# EasyEDA Pro project 终极板子.eprj

# Board 终极板子
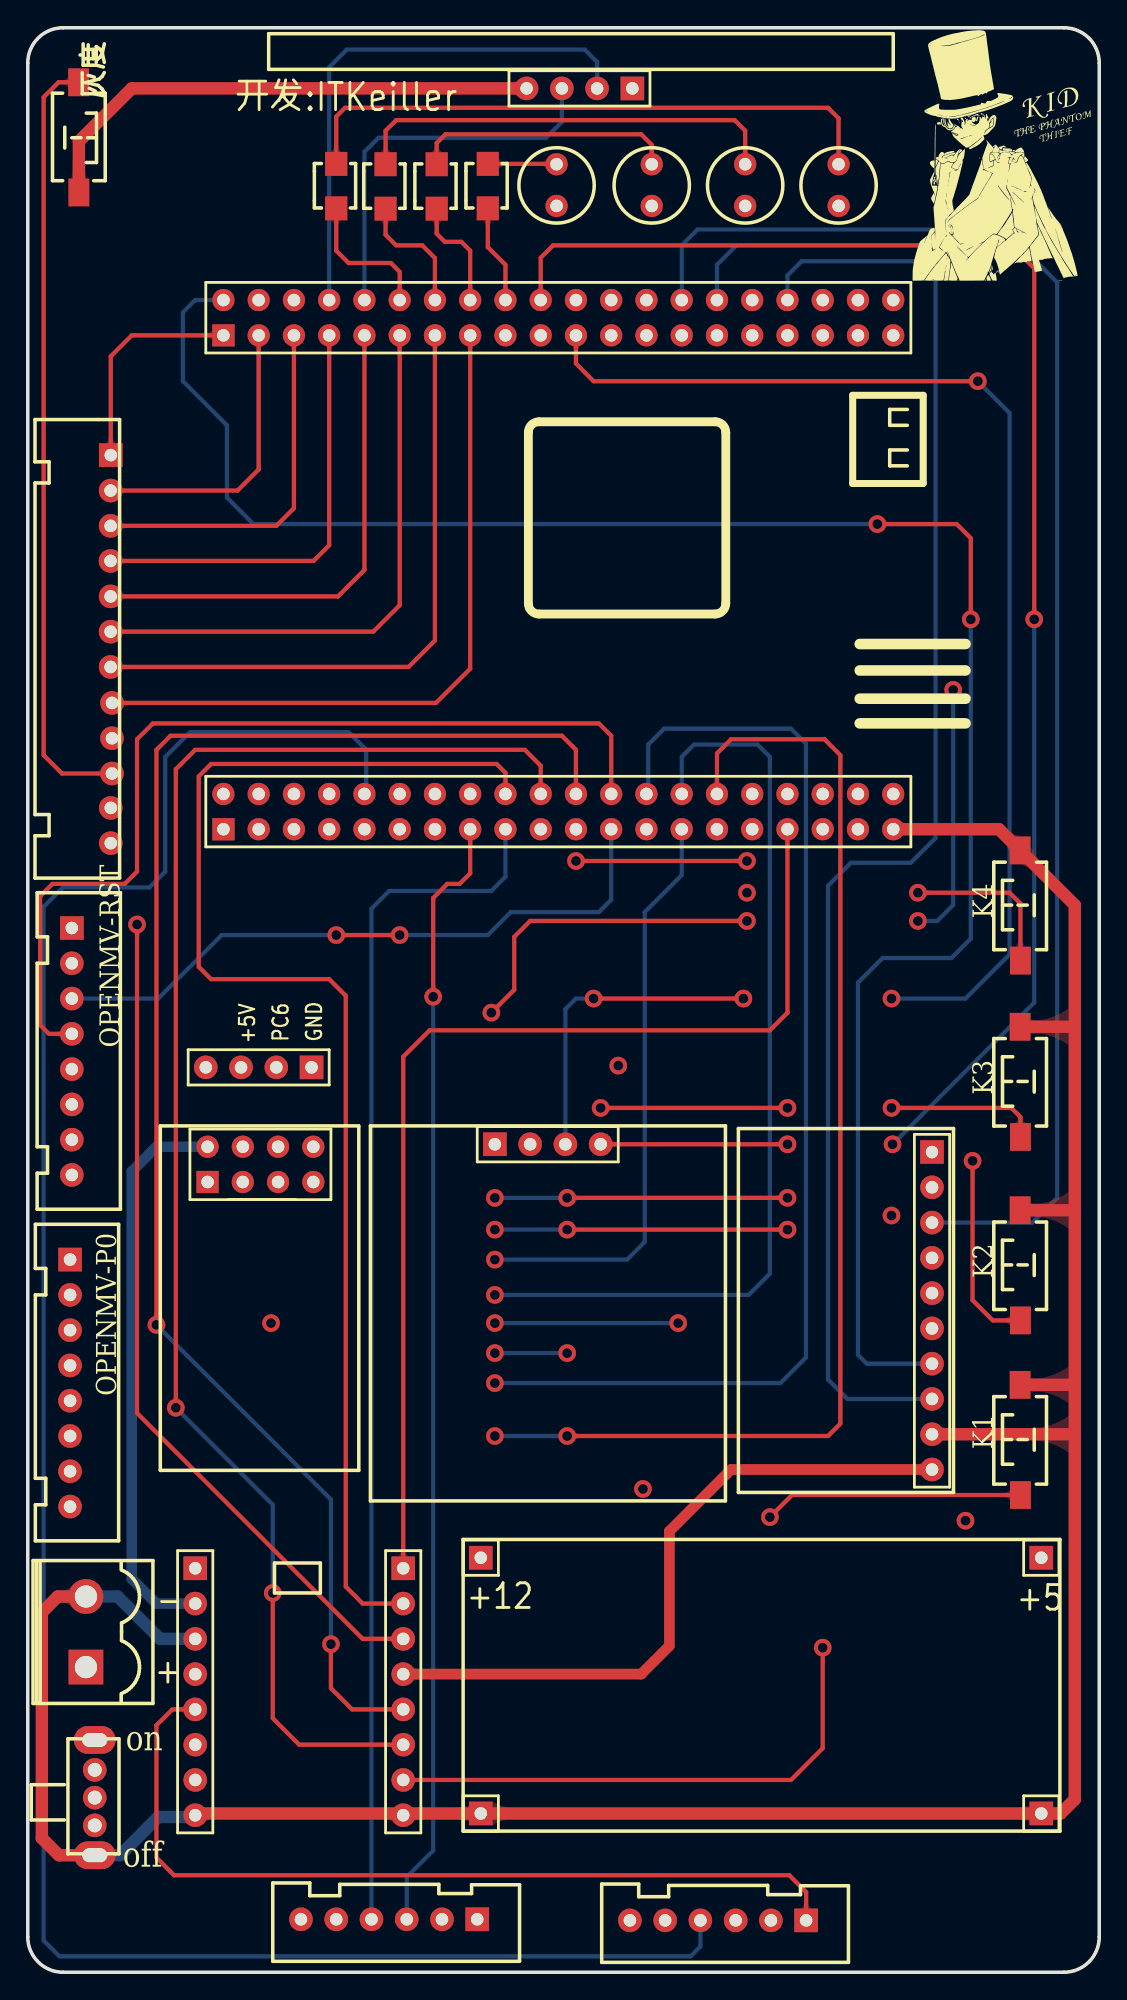
[diagram p0: board, top side]
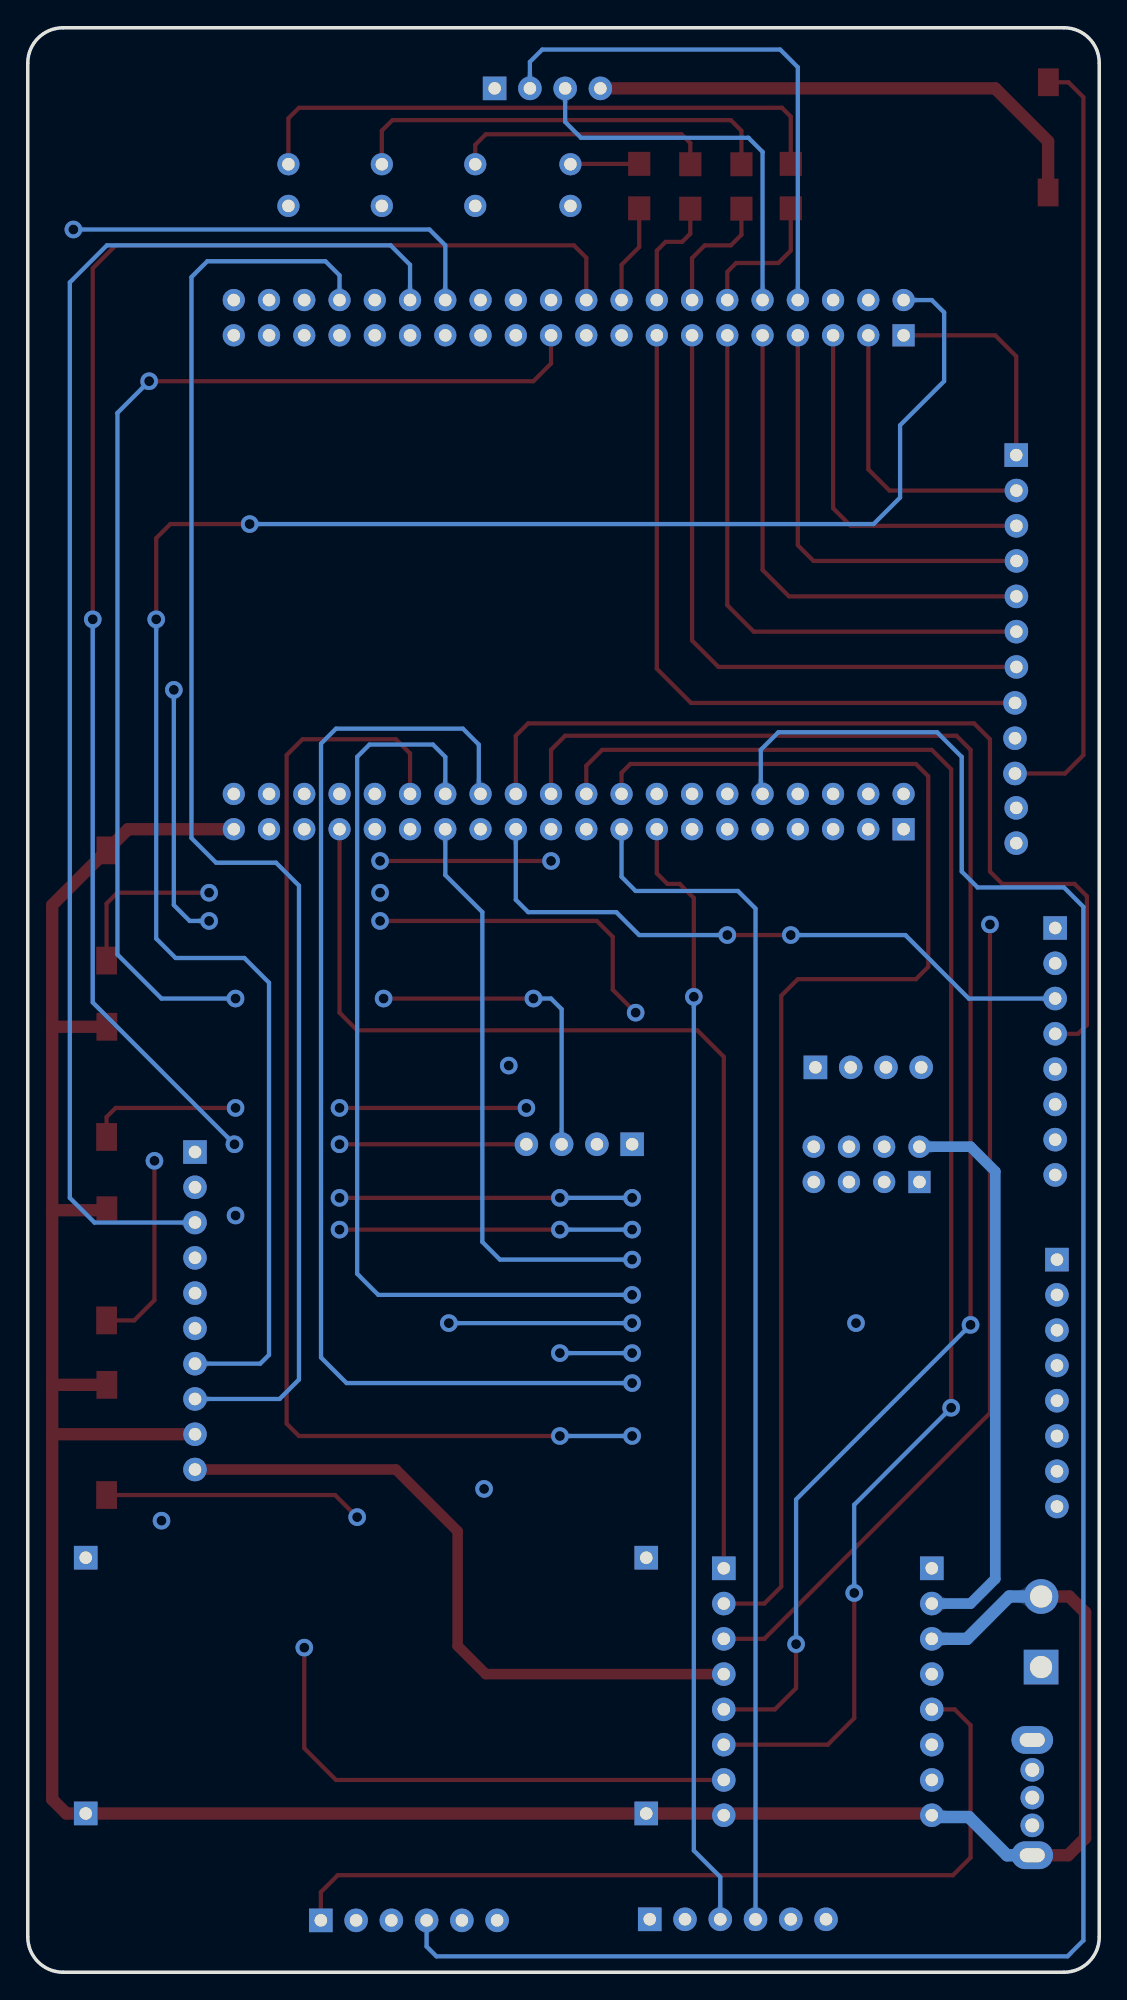
[diagram p1: board, bottom side, seen from below]

Outline 77.2 x 140 mm; copper layers: Top Layer, 第二层, 第三层, Bottom Layer. Coordinates in mm from the lower left corner of the outline.
Outline path: 0,137.46 0,2.54 arc(0.74,0.74) 2.54,0 74.66,0 arc(76.46,0.74) 77.2,2.54 77.2,137.46 arc(76.46,139.26) 74.66,140 2.54,140 arc(0.74,139.26) 0,137.46
Stack: Top Layer 0.035mm 外层铜厚1oz / Dielectric 2 0.0711mm PP-006 er 4.1 / 第二层 0.035mm - / Dielectric 1 0.32mm FR-4 er 4.8 / 第三层 0.035mm - / Dielectric 3 0.0711mm PP-006 er 4.1 / Bottom Layer 0.035mm 外层铜厚1oz

## Design rules (mm)
spacing Clearance (default): track to track 0.254, other pairs 0.254 to 0.254
track width Width (default): min 0.305, default 0.305, max 1.524
differential pair DiffPairsRouting (default): width min 0.381, default 0.381, max 0.381; gap min 0.254, default 0.254
via RoutingVias (default): diameter min 1.27, default 1.27, max 1.27; hole min 0.711, default 0.711, max 0.711

## Placement (name value [footprint] x y rotation side)
BUZZER  -  [HDR2.54-M-LI-4P]  16.64 65.15 180 top
ESP8266-01S  -  [ESP8266-01s]  3.56 53.34 90 top
GRAY  -  [XH2.54-1*12P]  3.18 96.56 0 top
HC-SR04  -  [HC-SR04]  37.21 138.43 270 top
K1  -  [贴片按键8mm]  71.5 38.35 90 top
K2  -  [贴片按键8mm]  71.5 50.93 90 top
K3  -  [贴片按键8mm]  71.5 64.14 90 top
K4  -  [贴片按键8mm]  71.5 76.84 90 top
LED1  -  [LED-3mm]  58.42 130.18 270 top
LED2  -  [LED-3mm]  51.69 130.18 270 top
LED3  -  [LED-3mm]  44.96 130.18 270 top
LED4  -  [LED-3mm]  38.1 130.18 270 top
MOTOR  12V-5V  [12V-5V-Blue]  31.37 14.22 0 top
MOTOR-A  -  [XH2.54-1*6P直]  51.18 1.14 90 top
MOTOR-B  -  [XH2.54-1*6P直]  27.48 1.22 90 top
MPU9250  -  [MPU9250]  65.02 53.09 0 top
OLED  -  [OLED]  33.65 59.44 90 top
ON-OFF  -  [拨动开关]  4.83 8.42 90 top
OPENMV-P0  -  [XH2.54-1*8P]  3.56 44.45 0 top
OPENMV-RST  -  [XH2.54-1*8P]  3.68 68.33 0 top
POWER  -  [立插端子-2P]  4.19 24.51 90 top
R1  -  [120Ω]  22.23 127 90 top
R2  -  [120Ω]  25.78 126.98 90 top
R3  -  [120Ω]  29.46 126.98 90 top
R4  -  [120Ω]  33.15 127 90 top
TB6612-L  -  [排母-1*8P]  11.56 20.83 0 top
TB6612-R  -  [排母-1*8P]  26.54 20.83 0 top
TYPE-C-L  -  [排母2*20P]  32 84.2 90 top
TYPE-C-R  -  [排母2*20P]  32 119.76 90 top
灰度  -  [贴片按键8mm]  3.68 132.08 270 top

## Footprints (pads in the part's own frame, mm; a bottom-side part is the same pattern mirrored in y, then rotated)
12V-5V-Blue
  rect 1.7x1.7 hole 0.9: 1(1.27,15.621) 2(1.27,-2.794) 3(41.656,15.621) 4(41.656,-2.794)
120Ω
  rect 1.727x1.6 smd: 1(0,0) 2(3.2,0)
ESP8266-01s
  rect 1.6x1.6 hole 0.9: 1(3.556,-9.398)
  round 1.6 hole 0.9: 2(3.556,-11.938) 3(3.556,-14.478) 4(3.556,-17.018) 5(6.096,-9.398) 6(6.096,-11.938) 7(6.096,-14.478) 8(6.096,-17.018)
HC-SR04
  rect 1.7x1.7 hole 0.9: 1(2.794,6.35)
  round 1.7 hole 0.9: 2(2.794,3.81) 3(2.794,1.27) 4(2.794,-1.27)
HDR2.54-M-LI-4P
  rect 1.7x1.7 hole 0.9: 1(-3.81,0)
  round 1.7 hole 0.9: 2(-1.27,0) 3(1.27,0) 4(3.81,0)
LED-3mm
  round 1.6 hole 0.9: 1(0,0) 2(3,0)
MPU9250
  rect 1.7x1.7 hole 0.9: 1(0.127,5.969)
  round 1.7 hole 0.9: 2(0.127,3.429) 3(0.127,0.889) 4(0.127,-1.651) 5(0.127,-4.191) 6(0.127,-6.731) 7(0.127,-9.271) 8(0.127,-11.811) 9(0.127,-14.351) 10(0.127,-16.891)
OLED
  rect 1.7x1.7 hole 0.9: 1(0.178,0)
  round 1.7 hole 0.9: 2(0.178,-2.54) 3(0.178,-5.08) 4(0.178,-7.62)
XH2.54-1*6P直
  round 1.7 hole 0.9: 1(2.591,7.798) 2(2.591,5.258) 3(2.591,2.718) 4(2.591,0.178) 5(2.591,-2.362)
  rect 1.7x1.7 hole 0.9: 6(2.591,-4.902)
XH2.54-1*8P
  rect 1.7x1.7 hole 0.9: 1(-0.508,6.858)
  round 1.7 hole 0.9: 2(-0.508,4.318) 3(-0.508,1.778) 4(-0.508,-0.762) 5(-0.508,-3.302) 6(-0.508,-5.842) 7(-0.508,-8.382) 8(-0.508,-10.922)
XH2.54-1*12P
  rect 1.7x1.7 hole 0.9: 1(2.804,12.675)
  round 1.7 hole 0.9: 2(2.791,10.122) 3(2.791,7.582) 4(2.784,5.054) 5(2.791,2.502) 6(2.791,-0.038) 7(2.791,-2.578) 8(2.892,-5.169) 9(2.892,-7.709) 10(2.892,-10.249) 11(2.804,-12.726) 12(2.804,-15.265)
拨动开关
  oval 1.999x2.999 hole 1.001x1.801: 1(0,0) 5(8.3,0)
  round 1.7 hole 1.001: 2(2.151,0) 3(4.151,0) 4(6.149,0)
排母2*20P
  rect 1.6x1.6 hole 0.9: 1(-1.905,17.907)
  round 1.6 hole 0.9: 2(0.635,17.907) 3(-1.905,15.367) 4(0.635,15.367) 5(-1.905,12.827) 6(0.635,12.827) 7(-1.905,10.287) 8(0.635,10.287) 9(-1.905,7.747) 10(0.635,7.747) 11(-1.905,5.207) 12(0.635,5.207) 13(-1.905,2.667) 14(0.635,2.667) 15(-1.905,0.127) 16(0.635,0.127) 17(-1.905,-2.413) 18(0.635,-2.413) 19(-1.905,-4.953) 20(0.635,-4.953) 21(-1.905,-7.493) 22(0.635,-7.493) 23(-1.905,-10.033) 24(0.635,-10.033) 25(-1.905,-12.573) 26(0.635,-12.573) 27(-1.905,-15.113) 28(0.635,-15.113) 29(-1.905,-17.653) 30(0.635,-17.653) 31(-1.905,-20.193) 32(0.635,-20.193) 33(-1.905,-22.733) 34(0.635,-22.733) 35(-1.905,-25.273) 36(0.635,-25.273) 37(-1.905,-27.813) 38(0.635,-27.813) 39(-1.905,-30.353) 40(0.635,-30.353)
排母-1*8P
  rect 1.7x1.7 hole 0.9: 1(0.508,8.255)
  round 1.7 hole 0.9: 2(0.508,5.715) 3(0.508,3.175) 4(0.508,0.635) 5(0.508,-1.905) 6(0.508,-4.445) 7(0.508,-6.985) 8(0.508,-9.525)
立插端子-2P
  rect 2.5x2.5 hole 1.6: 1(-2.54,0)
  round 2.5 hole 1.6: 2(2.54,0)
贴片按键8mm
  rect 2x1.5 smd: 1(-3.996,-0.02) 2(3.937,0)

## Nets
3.3V: TYPE-C-R.38
5V: BUZZER.3 GRAY.11 MOTOR.3 MOTOR-A.5 MOTOR-B.5 OLED.2 OPENMV-RST.2 TYPE-C-L.40
+3.3V: ESP8266-01S.5 MPU9250.10 TB6612-L.2 TB6612-R.4 TYPE-C-L.38
+5V: HC-SR04.1 TYPE-C-R.40
+12V: ON-OFF.3 POWER.1
AGND: MOTOR-A.2 MOTOR-B.2 TYPE-C-L.37
GND: HC-SR04.4 LED1.2 LED2.2 LED3.2 LED4.2 TYPE-C-R.39 灰度.2
VDD: MOTOR.1 ON-OFF.4 TB6612-L.1
A01: MOTOR-A.1 TB6612-L.4
A02: MOTOR-A.6 TB6612-L.5
AIN1: TB6612-R.3 TYPE-C-L.16
AIN2: TB6612-R.2 TYPE-C-L.18
B01: MOTOR-B.6 TB6612-L.7
B02: MOTOR-B.1 TB6612-L.6
BGND: TYPE-C-R.37
BIN1: TB6612-R.5 TYPE-C-L.22
BIN2: TB6612-R.6 TYPE-C-L.20
CGND: BUZZER.1 ESP8266-01S.4 GRAY.12 K1.2 K2.2 K3.2 K4.2 MOTOR.2 MOTOR.4 MPU9250.9 OLED.1 ON-OFF.1 OPENMV-RST.1 POWER.2 TB6612-L.3 TB6612-L.8 TB6612-R.8 TYPE-C-L.39
IIC1-SCL: OLED.3 TYPE-C-R.21
IIC1-SDA: OLED.4 TYPE-C-R.20
IIC2-SCL: OPENMV-RST.3 TYPE-C-L.23
IIC2-SDA: OPENMV-RST.4 TYPE-C-L.24
IIC3-SCL: MPU9250.8 TYPE-C-R.34
IIC3-SDA: MPU9250.7 TYPE-C-R.2
INT: MPU9250.3 TYPE-C-R.30
KEY: GRAY.10 灰度.1
L1: GRAY.1 TYPE-C-R.1
L2: GRAY.2 TYPE-C-R.3
L3: GRAY.3 TYPE-C-R.5
L4: GRAY.4 TYPE-C-R.7
L5: GRAY.5 TYPE-C-R.9
L6: GRAY.6 TYPE-C-R.11
L7: GRAY.7 TYPE-C-R.13
L8: GRAY.8 TYPE-C-R.15
LED1: R1.1 TYPE-C-R.12
LED2: R2.1 TYPE-C-R.14
LED3: R3.1 TYPE-C-R.16
LED4: R4.1 TYPE-C-R.18
NETLED1_1: LED1.1 R1.2
NETLED2_1: LED2.1 R2.2
NETLED3_1: LED3.1 R3.2
NETLED4_1: LED4.1 R4.2
PA2: K1.1 TYPE-C-L.1
PA4: K3.1 TYPE-C-L.5
PC4: K2.1 TYPE-C-L.9
PC6: BUZZER.2 TYPE-C-R.35
PE7: K4.1 TYPE-C-L.13
SPI2-MISO: OPENMV-P0.2 TYPE-C-L.28
SPI2-MOSI: OPENMV-P0.1 TYPE-C-L.27
SPI2-NSS: OPENMV-P0.4 TYPE-C-L.26
SPI2-SCK: OPENMV-P0.3 TYPE-C-L.25
TIM1-CH1: MOTOR-B.4 TYPE-C-L.15
TIM1-CH2: MOTOR-B.3 TYPE-C-L.17
TIM3-CH1: MOTOR-A.4 TYPE-C-L.7
TIM3-CH2: MOTOR-A.3 TYPE-C-L.10
TIM4-CH2: TB6612-R.1 TYPE-C-L.33
TIM4-CH4: TB6612-R.7 TYPE-C-L.35
TIM9-CH1: HC-SR04.3 TYPE-C-R.10
TRIG: HC-SR04.2 TYPE-C-R.8
UART2-RX: ESP8266-01S.8 TYPE-C-R.28
UART2-TX: ESP8266-01S.1 TYPE-C-R.29
UART3-RX: OPENMV-P0.5 TYPE-C-L.29
UART3-TX: OPENMV-P0.6 TYPE-C-L.30

Pads without a net: BUZZER 4; ESP8266-01S 2 3 6 7; GRAY 9; MPU9250 1 2 4 5 6; ON-OFF 2 5; OPENMV-P0 7 8; OPENMV-RST 5 6 7 8; TYPE-C-L 2 3 4 6 8 11 12 14 19 21 31 32 34 36; TYPE-C-R 4 6 17 19 22 23 24 25 26 27 31 32 33 36

## Via types
v1: diameter 1.27, hole 0.711, Top Layer to Bottom Layer, 52 vias

## Routing (per net, layer and track width the routed paths; a pad name or vN(x,y) marks a point on that pad's centre or on a via; arc(x,y) is an arc through that point)
5V: length 252.7
  第二层 w0.762: 53.53,29.84 53.54,29.83 MOTOR-A.5 53.59,3.68 53.59,2.29 52.58,1.27 30.99,1.27 29.84,2.41 MOTOR-B.5 ; 53.53,29.84 MOTOR.3 73.02,82.55 70.74,84.84 TYPE-C-L.40 ; 53.53,29.84 38.1,29.84 36.2,31.75 OLED.2 36.2,70.87 34.42,72.64 15.42,72.64 ; 15.42,72.64 15.37,72.59 BUZZER.3 ; 15.42,72.64 OPENMV-RST.2 2.03,72.64 1.27,73.41 1.27,82.8 2.3,83.83 5.98,83.83
+3.3V: length 176.9
  Top Layer w0.762: MPU9250.10 50.67,36.2 46.23,31.75 46.23,23.5 44.2,21.46 TB6612-R.4
  第二层 w0.762: TB6612-R.4 19.94,21.46 14.86,26.54 TB6612-L.2
  第三层 w0.762: MPU9250.10 69.09,36.2 70.36,37.47 70.36,87.38 68.96,88.77 61.09,88.77 59.82,87.5 TYPE-C-L.38
  Bottom Layer w0.762: ESP8266-01S.5 9.27,59.44 7.49,57.66 7.49,28.32 9.27,26.54 TB6612-L.2
+5V: length 33.4
  第三层 w0.762: HC-SR04.1 61.21,135.64 62.36,134.49 TYPE-C-R.40
+12V: length 14.9
  第二层 w0.762: ON-OFF.3 2.41,12.57 1.02,13.97 1.02,20.83 2.16,21.97 POWER.1
AGND: length 122.1
  第三层 w0.889: MOTOR-A.2 45.92,1.43 45.96,1.4 ; TYPE-C-L.37 59.82,2.41 58.8,1.4 45.96,1.4 ; 45.96,1.4 23.11,1.4 22.23,2.29 MOTOR-B.2
GND: length 93
  Top Layer w0.889: 灰度.2 3.68,131.83 7.49,135.64 HC-SR04.4
  第二层 w0.889: TYPE-C-R.39 62.48,117.73 68.2,117.73 69.34,118.87 69.34,125.6 67.77,127.18 LED1.2 LED2.2 LED3.2 LED4.2 35.94,129.33 HC-SR04.4
VDD: length 45
  第二层 w0.762: ON-OFF.4 6.57,14.57 7.62,15.62 7.62,27.69 9.02,29.08 TB6612-L.1 14.86,29.08 18.67,32.89 31.75,32.89 32.64,32 MOTOR.1
A01: length 52.6
  第二层 w0.305: MOTOR-A.1 43.38,5.89 42.55,6.73 10.8,6.73 9.4,8.13 9.4,20.57 10.29,21.46 TB6612-L.4
A02: length 62.7
  Top Layer w0.305: TB6612-L.5 10.41,18.92 9.27,17.78 9.27,8.26 10.54,6.99 54.86,6.99 56.08,5.77 MOTOR-A.6
AIN1: length 101.2
  Top Layer w0.305: v1(7.87,75.44) 7.87,40.26 24.13,24 TB6612-R.3
  第二层 w0.305: v1(7.87,75.44) 7.87,87.5 9.4,89.03 30.48,89.03 31.88,87.63 TYPE-C-L.16
AIN2: length 96.6
  Top Layer w0.305: TYPE-C-L.18 34.42,86.36 33.78,87 13.21,87 12.32,86.11 12.32,72.39 13.21,71.5 21.72,71.5 22.91,70.31 22.91,27.76 24.13,26.54 TB6612-R.2
B01: length 28.6
  第三层 w0.305: TB6612-L.7 14.22,13.84 15.11,12.95 15.11,9.78 16.13,8.76 31.37,8.76 32.39,7.75 MOTOR-B.6
B02: length 25.1
  第三层 w0.305: MOTOR-B.1 19.68,5.97 18.67,6.99 10.03,6.99 8.51,8.51 8.51,15.11 9.78,16.38 TB6612-L.6
BIN1: length 112.9
  Top Layer w0.305: v1(21.84,23.62) 21.84,20.45 23.37,18.92 TB6612-R.5 ; v1(9.27,46.61) 9.27,88.01 10.29,89.03 38.48,89.03 39.5,88.01 TYPE-C-L.22
  Bottom Layer w0.305: v1(21.84,23.62) 21.84,34.04 v1(9.27,46.61)
BIN2: length 110.8
  Top Layer w0.305: v1(17.65,27.31) 17.65,18.29 19.56,16.38 TB6612-R.6 ; v1(10.67,40.64) 10.67,86.61 12.06,88.01 35.81,88.01 36.96,86.87 TYPE-C-L.20
  Bottom Layer w0.305: v1(10.67,40.64) 17.65,33.66 v1(17.65,27.31)
CGND: length 317.7
  Top Layer w0.889: 75.44,38.61 75.44,12.45 74.42,11.43 MOTOR.4 MOTOR.2 12.19,11.43 TB6612-L.8 ; 75.44,38.61 75.32,38.74 MPU9250.9 ; 75.44,38.61 75.44,42.34 ; 75.44,54.65 75.44,68.28 ; 75.44,54.65 75.44,42.34 ; 75.44,54.65 75.22,54.86 71.5,54.86 ; 75.44,68.28 75.44,76.84 K4.2 69.98,82.3 TYPE-C-L.39 ; 75.44,68.28 75.23,68.07 K3.2 ; POWER.2 2.16,27.05 1.02,25.91 1.02,9.65 2.25,8.42 ON-OFF.1 ; 75.44,42.34 75.39,42.29 K1.2
  第三层 w0.889: OPENMV-RST.1 3.17,80.39 4.08,81.29 9.89,81.29 10.92,80.26 10.92,70.61 12.19,69.34 19.3,69.34 20.45,68.2 BUZZER.1 20.45,62.87 21.21,62.1 32.77,62.1 33.65,61.21 OLED.1 33.65,58.55 32.77,57.66 21.34,57.66 ESP8266-01S.4 20.57,25.65 18.92,24 TB6612-L.3
  Bottom Layer w0.889: TB6612-L.3 9.52,24 6.48,27.05 POWER.2 ; TB6612-L.8 11.94,11.18 9.4,11.18 6.64,8.42 ON-OFF.1
IIC1-SCL: length 117.1
  Top Layer w0.305: v1(68.45,114.55) 40.77,114.55 39.5,115.82 TYPE-C-R.21 ; v1(51.56,70.1) v1(40.77,70.1)
  第二层 w0.305: v1(51.56,70.1) v1(62.23,70.1)
  Bottom Layer w0.305: v1(62.23,70.1) 67.56,70.1 70.74,73.28 70.74,112.27 v1(68.45,114.55) ; v1(40.77,70.1) 39.5,70.1 38.73,69.34 OLED.3
IIC1-SDA: length 128
  Top Layer w0.305: OLED.4 v1(54.74,59.61) ; v1(72.52,97.41) 72.52,122.68 70.87,124.33 37.85,124.33 36.96,123.44 TYPE-C-R.20
  第二层 w0.305: v1(62.31,59.61) v1(54.74,59.61)
  Bottom Layer w0.305: v1(62.31,59.61) 72.52,69.82 v1(72.52,97.41)
IIC2-SCL: length 46.9
  Top Layer w0.305: v1(22.23,74.68) v1(26.8,74.68)
  Bottom Layer w0.305: TYPE-C-L.23 42.04,77.22 41.15,76.33 34.8,76.33 33.15,74.68 v1(26.8,74.68) ; OPENMV-RST.3 9.4,70.1 13.97,74.68 v1(22.23,74.68)
IIC2-SDA: length 68.3
  Top Layer w0.305: OPENMV-RST.4 1.52,67.56 0.89,68.2 0.89,77.47 1.78,78.36 6.98,78.36 7.87,79.25 7.87,88.77 9.02,89.92 41.15,89.92 42.04,89.03 TYPE-C-L.24
IIC3-SCL: length 106.5
  Bottom Layer w0.305: TYPE-C-R.34 54.74,122.17 55.75,123.19 64.26,123.19 65.4,122.05 65.4,81.66 63.63,79.88 59.31,79.88 57.66,78.23 57.66,42.67 59.05,41.28 MPU9250.8
IIC3-SDA: length 143.4
  Top Layer w0.305: v1(67.95,97.41) 67.95,103.25 66.93,104.27 v1(61.21,104.27)
  Bottom Layer w0.305: v1(61.21,104.27) 16.26,104.27 14.35,106.17 14.35,111.38 11.18,114.55 11.18,119.51 12.06,120.4 TYPE-C-R.2 ; MPU9250.7 60.45,43.81 59.82,44.45 59.82,71.25 61.59,73.03 66.55,73.03 67.95,74.42 v1(67.95,97.41)
INT: length 104.4
  Bottom Layer w0.305: MPU9250.3 72.39,53.98 74.17,55.75 74.17,121.67 71.5,124.33 51.05,124.33 49.66,122.94 TYPE-C-R.30
KEY: length 55.8
  Top Layer w0.305: 3.66,136.08 2.22,136.08 1.14,135 1.14,87.63 2.46,86.31 GRAY.10
L1: length 15.9
  Top Layer w0.305: TYPE-C-R.1 7.49,117.86 5.98,116.34 5.98,109.23
L2: length 21
  Top Layer w0.305: GRAY.2 15.11,106.68 16.64,108.2 TYPE-C-R.3
L3: length 26.2
  Top Layer w0.305: TYPE-C-R.5 19.18,105.41 17.91,104.14 GRAY.3
L4: length 31.3
  Top Layer w0.305: TYPE-C-R.7 21.72,102.74 20.59,101.61 GRAY.4
L5: length 36
  Top Layer w0.305: GRAY.5 22.35,99.06 24.26,100.97 TYPE-C-R.9
L6: length 41
  Top Layer w0.305: GRAY.6 24.89,96.52 26.8,98.43 TYPE-C-R.11
L7: length 46.1
  Top Layer w0.305: GRAY.7 27.43,93.98 29.34,95.89 TYPE-C-R.13
L8: length 50.8
  Top Layer w0.305: TYPE-C-R.15 31.88,93.85 29.41,91.39 GRAY.8
LED1: length 10.3
  Top Layer w0.305: TYPE-C-R.12 26.8,122.43 26.16,123.06 23.11,123.06 22.23,123.95 R1.1
LED2: length 9.2
  Top Layer w0.305: R2.1 25.78,125.1 26.54,124.33 28.42,124.33 29.34,123.42 TYPE-C-R.14
LED3: length 8.3
  Top Layer w0.305: TYPE-C-R.16 31.88,123.95 31.24,124.59 30.05,124.59 29.46,125.17 R3.1
LED4: length 7.1
  Top Layer w0.305: R4.1 33.15,124.21 34.42,122.94 TYPE-C-R.18
NETLED1_1: length 43.5
  Top Layer w0.305: R1.2 22.23,133.6 22.86,134.24 57.66,134.24 58.42,133.48 LED1.1
NETLED2_1: length 31.4
  Top Layer w0.305: R2.2 25.78,132.59 26.54,133.35 50.93,133.35 51.69,132.59 LED2.1
NETLED3_1: length 19
  Top Layer w0.305: R3.2 29.46,131.7 30.1,132.33 44.2,132.33 44.96,131.57 LED3.1
NETLED4_1: length 5
  Top Layer w0.305: LED4.1 38.08,130.2 R4.2
PA2: length 103.5
  Top Layer w0.305: K1.1 55.06,34.36 v1(53.47,32.77)
  第二层 w0.305: v1(53.47,32.77) 46.36,32.77 v1(44.32,34.8) ; TYPE-C-L.1 14.1,79.5 15.62,77.98 40.89,77.98 42.55,76.33 v1(42.55,65.28)
  第三层 w0.305: v1(42.55,65.28) 44.32,63.5 v1(44.32,34.8)
PA4: length 71.7
  Top Layer w0.305: K3.1 71.52,61.58 70.87,62.23 v1(62.23,62.23) ; v1(54.74,62.23) v1(41.27,62.23)
  第二层 w0.305: v1(62.23,62.23) v1(54.74,62.23)
  第三层 w0.305: TYPE-C-L.5 19.18,73.66 20.83,72.01 36.2,72.01 37.97,70.23 37.97,62.99 38.73,62.23 v1(41.27,62.23)
PC4: length 80.4
  Top Layer w0.305: v1(68.07,58.42) 68.07,48.39 69.53,46.93 K2.1 ; v1(51.82,80.01) v1(39.5,80.01)
  第二层 w0.305: TYPE-C-L.9 24.26,80.9 25.15,80.01 v1(39.5,80.01) ; v1(68.07,58.42) 68.07,78.49 66.55,80.01 v1(51.82,80.01)
PC6: length 105.4
  Top Layer w0.305: v1(33.4,69.09) 35.05,70.74 35.05,74.55 36.2,75.69 v1(51.82,75.69)
  第二层 w0.305: BUZZER.2 17.91,68.07 18.92,69.09 v1(33.4,69.09) ; v1(66.67,92.33) 66.67,94.62 64.64,96.65 59.56,96.65 57.28,98.93 TYPE-C-R.35 ; v1(51.82,75.69) v1(64.14,75.69)
  Bottom Layer w0.305: v1(64.14,75.69) 65.53,75.69 66.67,76.84 v1(66.67,92.33)
PE7: length 50.4
  Top Layer w0.305: v1(64.14,77.72) 70.74,77.72 71.52,76.94 K4.1
  第二层 w0.305: v1(51.82,77.72) v1(64.14,77.72)
  第三层 w0.305: TYPE-C-L.13 29.34,79.12 30.73,77.72 v1(51.82,77.72)
SPI2-MISO: length 98
  第二层 w0.305: v1(33.65,48.77) 3.05,48.77
  Bottom Layer w0.305: TYPE-C-L.28 47.12,87.5 48.01,88.39 52.58,88.39 53.47,87.5 53.47,50.29 51.94,48.77 v1(33.65,48.77)
SPI2-MOSI: length 72.8
  第二层 w0.305: 3.05,51.31 v1(33.65,51.31)
  Bottom Layer w0.305: TYPE-C-L.27 47.12,78.99 44.45,76.33 44.45,52.58 43.18,51.31 v1(33.65,51.31)
SPI2-NSS: length 114.4
  第二层 w0.305: OPENMV-P0.4 5.84,43.69 7.11,42.42 v1(33.65,42.42)
  Bottom Layer w0.305: TYPE-C-L.26 44.7,84.96 44.7,88.39 45.85,89.54 54.99,89.54 56.07,88.46 56.07,44.26 54.23,42.42 v1(33.65,42.42)
SPI2-SCK: length 79.3
  第二层 w0.305: v1(38.86,44.58) 43.43,44.58 44.58,45.72 TYPE-C-L.25 ; v1(33.65,44.58) 7.62,44.58 5.97,46.23 OPENMV-P0.3
  Bottom Layer w0.305: v1(33.65,44.58) v1(38.86,44.58)
TIM1-CH1: length 80.9
  Top Layer w0.305: TYPE-C-L.15 31.88,79.12 31.11,78.36 30.23,78.36 29.21,77.34 v1(29.21,70.23)
  Bottom Layer w0.305: MOTOR-B.4 27.3,6.86 29.21,8.76 v1(29.21,70.23)
TIM1-CH2: length 86.8
  Bottom Layer w0.305: MOTOR-B.3 24.77,76.58 26.03,77.85 33.4,77.85 34.42,78.87 TYPE-C-L.17
TIM3-CH1: length 100.8
  第三层 w0.305: TYPE-C-L.7 21.72,79.12 24.51,76.33 41.78,76.33 51,67.11 MOTOR-A.4
TIM3-CH2: length 161.4
  Bottom Layer w0.305: TYPE-C-L.10 24.38,84.96 24.38,88.01 23.11,89.28 11.68,89.28 9.91,87.5 9.91,79.25 8.76,78.11 2.54,78.11 1.14,76.71 1.14,2.29 2.29,1.14 47.75,1.14 48.46,1.85 MOTOR-A.3
TIM4-CH2: length 79
  Top Layer w0.305: TB6612-R.1 27.05,65.91 28.96,67.82 53.47,67.82 54.74,69.09 TYPE-C-L.33
TIM4-CH4: length 97.3
  Top Layer w0.305: TB6612-R.7 54.99,13.84 57.28,16.13 v1(57.28,23.37)
  第三层 w0.305: v1(57.28,23.37) TYPE-C-L.35
TIM9-CH1: length 28.2
  Bottom Layer w0.305: TYPE-C-R.10 24.26,131.06 25.27,132.08 37.34,132.08 38.48,133.22 HC-SR04.3
TRIG: length 38.9
  Bottom Layer w0.305: HC-SR04.2 41.02,137.54 40.13,138.43 22.99,138.43 21.72,137.16 TYPE-C-R.8
UART2-RX: length 211.9
  Top Layer w0.305: v1(38.86,55.75) v1(54.74,55.75)
  第二层 w0.305: v1(33.65,55.75) 26.29,55.75 22.61,59.44 ESP8266-01S.8 ; v1(54.74,55.75) 60.96,55.75 v1(62.23,54.48)
  第三层 w0.305: v1(62.23,54.48) 62.23,29.46 64.14,27.56 74.17,27.56 75.69,29.08 75.69,123.7 v1(73.91,125.48)
  Bottom Layer w0.305: v1(73.91,125.48) 48.26,125.48 47.12,124.33 TYPE-C-R.28 ; v1(33.65,55.75) v1(38.86,55.75)
UART2-TX: length 189.3
  Top Layer w0.305: v1(38.86,53.47) v1(54.74,53.47)
  第二层 w0.305: v1(54.74,53.47) 60.45,53.47 62.74,51.18 62.74,33.66 63.88,32.51 v1(67.56,32.51) ; v1(33.65,53.47) 14.1,53.47 12.95,54.61 ESP8266-01S.1
  第三层 w0.305: v1(67.56,32.51) 72.14,32.51 74.17,34.54 74.17,99.19 72.26,101.09 51.69,101.09 49.66,103.12 TYPE-C-R.29
  Bottom Layer w0.305: v1(33.65,53.47) v1(38.86,53.47)
UART3-RX: length 87.9
  第二层 w0.305: v1(46.86,46.74) 51.43,46.74 52.58,47.88 52.58,65.79 49.66,68.71 TYPE-C-L.29 ; v1(17.53,46.74) v1(33.65,46.74)
  第三层 w0.305: v1(17.53,46.74) 13.59,46.74 8,41.15 OPENMV-P0.5
  Bottom Layer w0.305: v1(46.86,46.74) v1(33.65,46.74)
UART3-TX: length 116.7
  Top Layer w0.305: TYPE-C-L.30 49.66,87.76 50.67,88.77 57.4,88.77 58.55,87.63 58.55,39.5 57.66,38.61 v1(38.86,38.61)
  第二层 w0.305: v1(33.65,38.61) OPENMV-P0.6
  Bottom Layer w0.305: v1(33.65,38.61) v1(38.86,38.61)

## Copper pours and planes (outline as drawn; the poured copper is in the pictures)
GND on Top Layer: -8.64,146.3 89.41,146.3 89.41,-15.37 -8.64,-15.37
GND on Bottom Layer: -14.73,154.43 94.23,154.43 94.23,-25.53 -14.73,-25.53
GND on 第二层: -19.81,159.89 97.54,159.89 97.54,-30.61 -19.81,-30.61
GND on 第三层: -26.92,169.67 110.49,169.67 110.49,-35.05 -26.92,-35.05

Small or netless copper shapes (teardrops, artwork), in the pictures only: 108 on Top Layer, 58 on Bottom Layer, 82 on 第二层, 37 on 第三层

## Text on the board
Top Silkscreen Layer: +5V | PC6 | GND | + | - | +12 | +5 | off | on | 开发:ITKeiller
